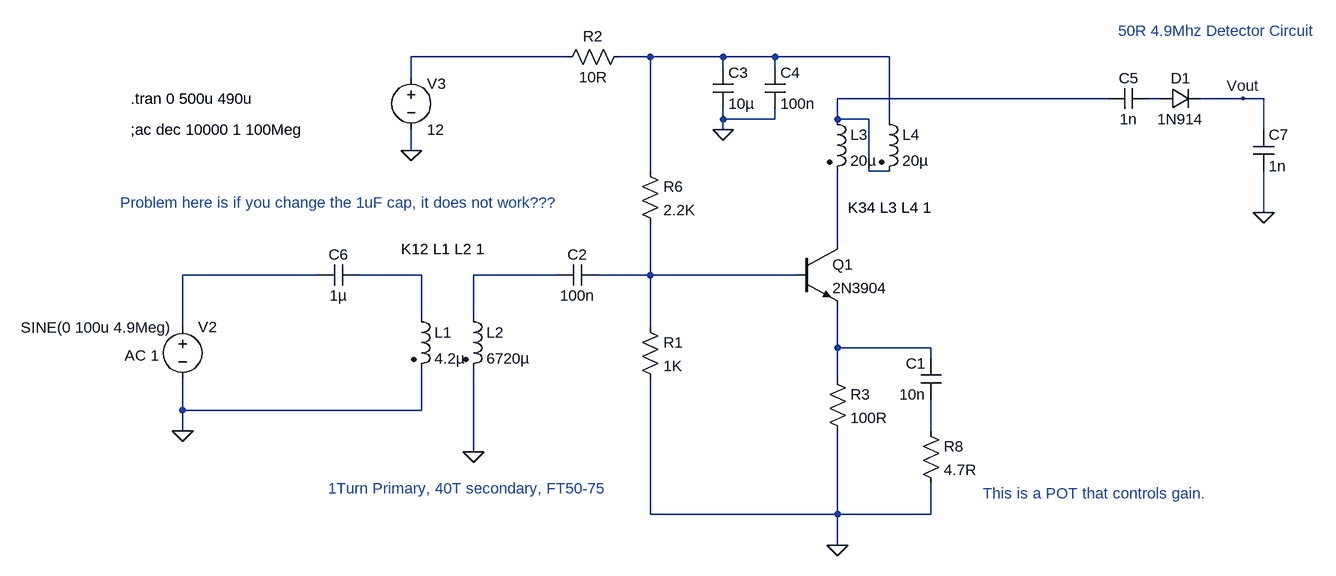
[diagram p0: schematic IF Detector Test 2.asc]
IF Detector Test 2.asc, the LTspice schematic file:
Version 4
SHEET 1 3064 708
WIRE 1808 -256 1568 -256
WIRE 1936 -256 1888 -256
WIRE 2048 -256 1936 -256
WIRE 2128 -256 2048 -256
WIRE 2304 -256 2128 -256
WIRE 2048 -240 2048 -256
WIRE 2128 -240 2128 -256
WIRE 1568 -224 1568 -256
WIRE 2640 -192 2224 -192
WIRE 2720 -192 2704 -192
WIRE 2848 -192 2784 -192
WIRE 2880 -192 2848 -192
WIRE 2048 -160 2048 -176
WIRE 2128 -160 2128 -176
WIRE 2128 -160 2048 -160
WIRE 2224 -160 2224 -192
WIRE 2272 -160 2224 -160
WIRE 2304 -160 2304 -256
WIRE 2048 -144 2048 -160
WIRE 2880 -144 2880 -192
WIRE 1568 -112 1568 -144
WIRE 1936 -80 1936 -256
WIRE 2272 -80 2272 -160
WIRE 2304 -80 2272 -80
WIRE 2880 -16 2880 -80
WIRE 2224 32 2224 -80
WIRE 1424 80 1216 80
WIRE 1584 80 1488 80
WIRE 1792 80 1664 80
WIRE 1936 80 1936 0
WIRE 1936 80 1856 80
WIRE 2160 80 1936 80
WIRE 1584 144 1584 80
WIRE 1664 144 1664 80
WIRE 1216 160 1216 80
WIRE 1936 160 1936 80
WIRE 2224 192 2224 128
WIRE 2368 192 2224 192
WIRE 2368 208 2368 192
WIRE 2224 240 2224 192
WIRE 1216 288 1216 240
WIRE 1584 288 1584 224
WIRE 1584 288 1216 288
WIRE 1216 320 1216 288
WIRE 2368 320 2368 272
WIRE 1664 352 1664 224
WIRE 1936 448 1936 240
WIRE 2224 448 2224 320
WIRE 2224 448 1936 448
WIRE 2368 448 2368 400
WIRE 2368 448 2224 448
WIRE 2224 496 2224 448
FLAG 1216 320 0
FLAG 1664 352 0
FLAG 1568 -112 0
FLAG 2224 496 0
FLAG 2048 -144 0
FLAG 2880 -16 0
FLAG 2848 -192 Vout
SYMBOL voltage 1216 144 R0
WINDOW 123 -89 60 Left 2
WINDOW 39 0 0 Left 2
WINDOW 3 -249 17 Left 2
SYMATTR Value2 AC 1
SYMATTR Value SINE(0 100u 4.9Meg)
SYMATTR InstName V2
SYMBOL ind2 1568 128 R0
SYMATTR InstName L1
SYMATTR Value 4.2µ
SYMATTR Type ind
SYMBOL ind2 1648 128 R0
SYMATTR InstName L2
SYMATTR Value 6720µ
SYMATTR Type ind
SYMBOL npn 2160 32 R0
SYMATTR InstName Q1
SYMATTR Value 2N3904
SYMBOL res 1920 144 R0
SYMATTR InstName R1
SYMATTR Value 1K
SYMBOL cap 2384 272 R180
WINDOW 0 24 56 Left 2
WINDOW 3 24 8 Left 2
SYMATTR InstName C1
SYMATTR Value 10n
SYMBOL cap 1856 64 R90
WINDOW 0 0 32 VBottom 2
WINDOW 3 32 32 VTop 2
SYMATTR InstName C2
SYMATTR Value 100n
SYMBOL res 1904 -272 R90
WINDOW 0 0 56 VBottom 2
WINDOW 3 32 56 VTop 2
SYMATTR InstName R2
SYMATTR Value 10R
SYMBOL voltage 1568 -240 R0
WINDOW 0 24 25 Left 2
WINDOW 123 0 0 Left 2
WINDOW 39 0 0 Left 2
SYMATTR InstName V3
SYMATTR Value 12
SYMBOL ind2 2208 -176 R0
SYMATTR InstName L3
SYMATTR Value 20µ
SYMATTR Type ind
SYMBOL ind2 2288 -176 R0
SYMATTR InstName L4
SYMATTR Value 20µ
SYMATTR Type ind
SYMBOL res 2208 224 R0
SYMATTR InstName R3
SYMATTR Value 100R
SYMBOL cap 2032 -240 R0
SYMATTR InstName C3
SYMATTR Value 10µ
SYMBOL res 1920 -96 R0
SYMATTR InstName R6
SYMATTR Value 2.2K
SYMBOL cap 2112 -240 R0
SYMATTR InstName C4
SYMATTR Value 100n
SYMBOL res 2352 304 R0
SYMATTR InstName R8
SYMATTR Value 4.7R
SYMBOL cap 2704 -208 R90
WINDOW 0 0 32 VBottom 2
WINDOW 3 32 32 VTop 2
SYMATTR InstName C5
SYMATTR Value 1n
SYMBOL diode 2720 -176 R270
WINDOW 0 32 32 VTop 2
WINDOW 3 0 32 VBottom 2
SYMATTR InstName D1
SYMATTR Value 1N914
SYMBOL cap 2864 -144 R0
SYMATTR InstName C7
SYMATTR Value 1n
SYMBOL cap 1488 64 R90
WINDOW 0 0 32 VBottom 2
WINDOW 3 32 32 VTop 2
SYMATTR InstName C6
SYMATTR Value 1µ
TEXT 1136 -192 Left 2 !.tran 0 500u 490u
TEXT 1136 -144 Left 2 !;ac dec 10000 1 100Meg
TEXT 1552 40 Left 2 !K12 L1 L2 1
TEXT 1440 408 Left 2 ;1Turn Primary, 40T secondary, FT50-75
TEXT 2240 -24 Left 2 !K34 L3 L4 1
TEXT 2448 416 Left 2 ;This is a POT that controls gain.
TEXT 2656 -296 Left 2 ;50R 4.9Mhz Detector Circuit
TEXT 1120 -32 Left 2 ;Problem here is if you change the 1uF cap, it does not work???

The netlist it stands for:
* IF Detector Test 2.asc
V2 N006 0 SINE(0 100u 4.9Meg) AC 1
L1 N007 0 4.2µ
L2 N008 0 6720µ
Q1 N005 N009 N010 0 2N3904
R1 N009 0 1K
C1 N011 N010 10n
C2 N009 N008 100n
R2 N002 N001 10R
V3 N001 0 12
L3 N003 N005 20µ
L4 N002 N003 20µ
R3 N010 0 100R
C3 N002 0 10µ
R6 N002 N009 2.2K
C4 N002 0 100n
R8 N011 0 4.7R
C5 N004 N003 1n
D1 N004 Vout 1N914
C7 Vout 0 1n
C6 N007 N006 1µ
.model D D
.lib standard.dio
.model NPN NPN
.model PNP PNP
.lib standard.bjt
.tran 0 500u 490u
;ac dec 10000 1 100Meg
K12 L1 L2 1
* 1Turn Primary, 40T secondary, FT50-75
K34 L3 L4 1
* This is a POT that controls gain.
* 50R 4.9Mhz Detector Circuit
* Problem here is if you change the 1uF cap, it does not work???
.backanno
.end